# Altium schematic sheet Arduino_extension_connectors.SchDoc: Arduino extension connectors
size A4; Date: Not used; ApprovedBy: Not used; CheckedBy: Not used; Author: Not used; CompanyName: STMicroelectronics; DrawnBy: Not used; Engineer: Not used; Organization: Not used; Address1: Not used; Address2: Not used; Address3: Not used; Address4: Not used; DocumentNumber: Not used; Revision: Not used; SheetNumber: 6; SheetTotal: 7; CurrentTime: Not used; CurrentDate: Not used; Time: Not used; DocumentFullPathAndName: Not used; DocumentName: Not used; ModifiedDate: Not used; ImagePath: Not used; ProjectName: Not used; Application_BuildNumber: Not used
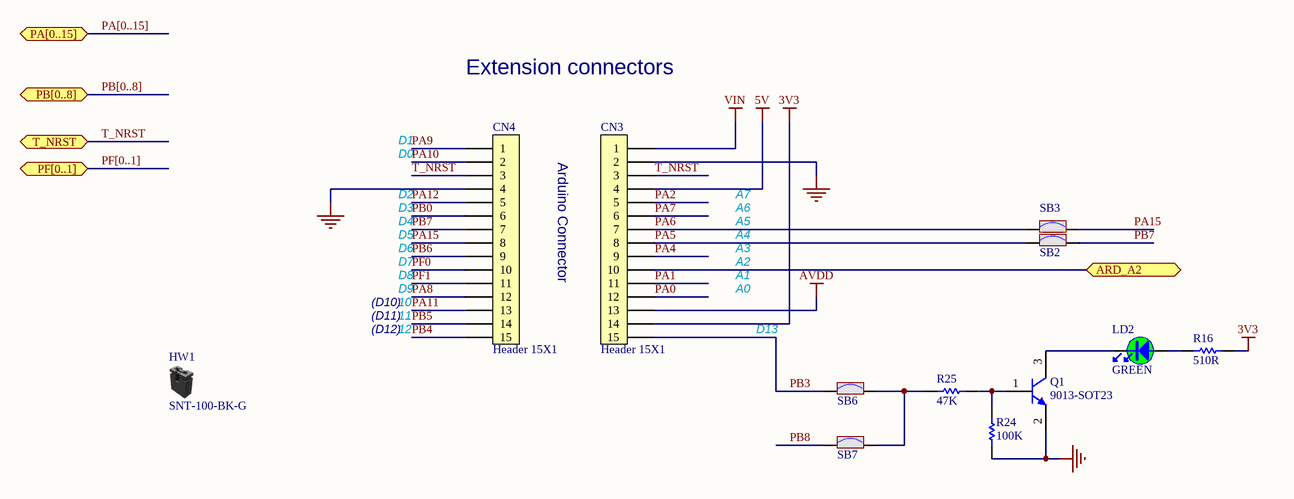
[diagram p0: Arduino_extension_connectors.SchDoc]

## Parts
CN3  value Header 15X1  [CON_LYCN_313115S161145]
CN4  value Header 15X1  [CON_LYCN_313115S161145]
HW1  value SNT-100-BK-G  (hidden comment: Shunt Black 2.54mm)  (mechanical)
LD2  value GREEN  [LED_0603_GREEN]
Q1  value 9013-SOT23  [NPN_SOT23]
R16  value 510R  [R0402]
R24  value 100K  [R0402]
R25  value 47K  [R0402]
SB2  (no value)  [SOLDER-BRIDGE_R0603-0R]
SB3  (no value)  [SOLDER-BRIDGE_R0603-0R]
SB6  (no value)  [SOLDER-BRIDGE_R0603-0R]
SB7  (no value)  [SOLDER-BRIDGE_R0603-0R]

## Ports
ARD_A2, PA[0..15] (bidir), PB[0..8] (bidir), PF[0..1] (bidir), T_NRST

## Nets
3V3: CN3.14 R16.2
5V: CN3.4
AVDD: CN3.13
GND: CN3.2 CN4.4 Q1.2(E) R24.1
VIN: CN3.1
ARD_A2: CN3.10 ; port ARD_A2
PA0: CN3.12
PA1: CN3.11
PA2: CN3.5
PA4: CN3.9
PA5: CN3.8 SB2.1
PA6: CN3.7 SB3.1
PA7: CN3.6
PA8: CN4.12
PA9: CN4.1
PA10: CN4.2
PA11: CN4.13
PA12: CN4.5
PA15: CN4.8 SB3.2
PB0: CN4.6
PB3: CN3.15 SB6.1
PB4: CN4.15
PB5: CN4.14
PB6: CN4.9
PB7: CN4.7 SB2.2
PB8: SB7.1
PF0: CN4.10
PF1: CN4.11
T_NRST: CN3.3 CN4.3 ; port T_NRST
NetLD2_1: LD2.1 R16.1
NetLD2_2: LD2.2 Q1.3(C)
NetQ1_1: Q1.1(B) R24.2 R25.2
NetR25_1: R25.1 SB6.2 SB7.2

## Buses and harness runs
bus PA[0..15] = port PA[0..15]
bus PB[0..8] = port PB[0..8]
bus PF[0..1] = port PF[0..1]

## Notes on the sheet
- Extension connectors
- D0
- D1
- D2
- Arduino Connector
- A7
- D4
- D3
- D5
- D6
- D7
- A2
- A3
- A4
- A5
- A6
- (D10)
- (D12)
- (D11)
- D8
- D9
- 10
- 12
- 11
- A0
- A1
- D13
- Title:
- Project:
- Size:
- Revision:
- Variant:
- -
- Date:
- Reference:
- Sheet:
- of

## Library data of the parts
CN3 CN4 = MCD-01332: Pin header, 15x1, 2,54mm, VR, TH, Height 6mm/6mm; Part_Type: Connector; Manufacturer_Part_Number: 313115S161145; Manufacturer: LYCN; Provided_By: SUBCO; Initial_Board_Reference: tbd; Remark: Official footprint by subcon done.; Internal_Part_Number: MCD-01332; Status: Footprint available; ComponentLink1Description: Datasheet; ComponentLink1URL: http://tunmcdsvn.tun.st.com/Component_Datasheet_Library/Trunk/Connectors/LYCN_3131xxS141
HW1 = MCD-00043: SHUNT 2.54mm BLACK; Part_Type: Mechanical; Manufacturer: SAMTEC; Provided_By: SUBCO; Internal_Part_Number: MCD-00043; Status: Released; Manufacturer_Part_Number: SNT-100-BK-G; ComponentLink1Description: Datasheet; ComponentLink1URL: http://tunmcdsvn.tun.st.com/Component_Datasheet_Library/Trunk/Connectors/Samtec_Shunt_Jumper_SNT100
LD2 = MCD-00050: LED, Green, 0603; Manufacturer_Part_Number: 19-213SYGC/S530-E2/TR8; Manufacturer: EVERLIGHT; Part_Type: Display; Provided_By: SUBCO; Initial_Board_Reference: MB1274; Internal_Part_Number: MCD-00050; ComponentLink1Description: Datasheet; Status: Released; ComponentLink1URL: http://tunmcdsvn.tun.st.com/Component_Datasheet_Library/Trunk/Display/Everlight_SMD-LED-GREEN_19-213SYGC-S530-XX-TR8-v3.doc; Package: LED 0603
Q1 = MCD-00073: NPN Bipolar Transistor; Part_Type: IC; Manufacturer_Part_Number: BSR14; Manufacturer: NXP; Provided_By: SUBCO; Initial_Board_Reference: MB1274; Revision: *; Internal_Part_Number: MCD-00073; Status: Released; ComponentLink1Description: Datasheet; ComponentLink1URL: http://tunmcdsvn.tun.st.com/Component_Datasheet_Library/Trunk/IC/NXP_Transistor_BSR14
R16 = MCD-00064: Resistor,510R,0402,1%,1/16W; Manufacturer_Part_Number: RC0402FR-07510RL; Manufacturer: YAGEO; Provided_By: SUBCO; Initial_Board_Reference: MB1274; Internal_Part_Number: MCD-00064; Status: Released; Part_Type: Resistor; Package: R0402; ComponentLink1Description: Datasheet; ComponentLink1URL: http://tunmcdsvn.tun.st.com/Component_Datasheet_Library/Trunk/Resistors/Yageo_Resistor_RC0402-series
R24 = MCD-00059: Resistor,100K,0402,1%,1/16W; Manufacturer_Part_Number: RC0402FR-07100KL; Manufacturer: YAGEO; Alternate_Manufacturer_Part_Number: RT0402FRE07100KL; Provided_By: SUBCO; Initial_Board_Reference: MB1274; Internal_Part_Number: MCD-00059; Status: Released; Part_Type: Resistor; Alternate_Manufacturer: YAGEO; Package: R0402; ComponentLink1Description: Datasheet; ComponentLink1URL: http://tunmcdsvn.tun.st.com/Component_Datasheet_Library/Trunk/Resistors/Yageo_Resistor_RC0402-series
R25 = MCD-00063: Resistor,47K,0402,1%,1/16W; Manufacturer_Part_Number: RC0402FR-0747KL; Manufacturer: YAGEO; Provided_By: SUBCO; Initial_Board_Reference: MB1274; Internal_Part_Number: MCD-00063; Status: Released; Part_Type: Resistor; Package: R0402; ComponentLink1Description: Datasheet; ComponentLink1URL: http://tunmcdsvn.tun.st.com/Component_Datasheet_Library/Trunk/Resistors/Yageo_Resistor_RC0402-series
SB2 SB3 SB6 SB7 = MCD-00071: Solder Bridge ON; Part_Type: Mechanical; Manufacturer_Part_Number: RC0603JR-070RL; Manufacturer: YAGEO; Provided_By: SUBCO; Initial_Board_Reference: MB1274; Internal_Part_Number: MCD-00071; Status: Released; ComponentLink1Description: Datasheet; Package: SB0603; ComponentLink1URL: http://tunmcdsvn.tun.st.com/Component_Datasheet_Library/Trunk/Resistors/Yageo_Resistor_RC0603-series